# Altium schematic sheet Magnetic-Charger.SchDoc
size A; SheetNumber: 14; SheetTotal: 17
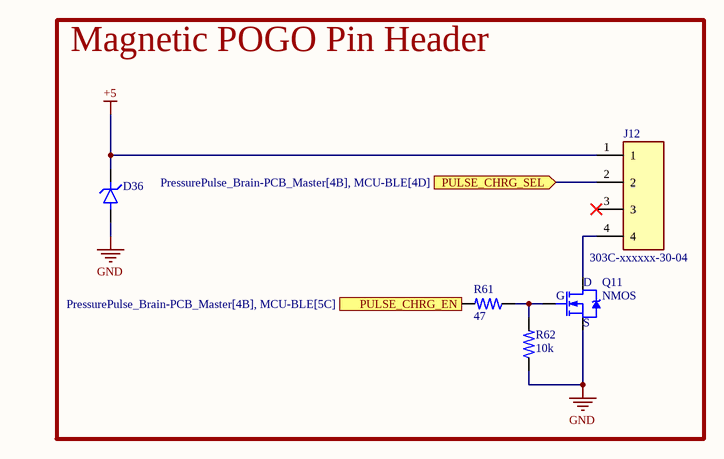
[diagram p0: Magnetic-Charger.SchDoc]

## Parts
D36  RCLAMP0521P.TCT  [BDFN2C051V40]  (value not drawn)
J12  303C-xxxxxx-30-04  [MAG POGO - 4 POS MALE]
Q11  NMOS  [SOT-23]
R61  value 47  [0402R]  (hidden comment: RES)
R62  value 10k  [0402R]  (hidden comment: RES)

## Blocks framed on the sheet
Magnetic POGO Pin Header: D36 J12 Q11 R61 R62

## Ports
PULSE_CHRG_EN (in, see PressurePulse_Brain-PCB_Master[4B], MCU-BLE[5C]), PULSE_CHRG_SEL (in, see PressurePulse_Brain-PCB_Master[4B], MCU-BLE[4D])

## Nets
+5: D36.K J12.1
GND: D36.A Q11.S R62.1
PULSE_CHRG_EN: R61.2 ; port PULSE_CHRG_EN
PULSE_CHRG_SEL: J12.2 ; port PULSE_CHRG_SEL
NetJ12_4: J12.4 Q11.D
NetQ11_G: Q11.G R61.1 R62.2

Not connected (* = marked no-connect by the designer): J12 3*

## Library data of the parts
D36 = TVS DIODE: 25V Clamp 4A (8/20µs) Ipp Tvs Diode Surface Mount SLP1006P2; MFR: BORN; Type: SMD; Value: BDFN2C051V40; MFR PN: BDFN2C051V40; JLCPCB PN: C152023
J12 = 303C-xxxxxx-30-04: MAGNETIC POGO 4POS; MFR: ATTEND Technology; MFR PN: 303C-321018-30-04; Value: DNS; JLCPCB PN: *
Q11 = NMOS: 100V 1.6A 1.3W 220mΩ@10V,1.6A N Channel SOT-23  MOSFETs ROHS; MFR: Infineon; Value: IRLML0100TRPBF; MFR PN: IRLML0100TRPBF; JLCPCB PN: C53658
R61 R62 = RES: Resistor; MFR PN: *; MFR: *
  R61: JLCPCB PN: *
  R62: JLCPCB PN: C843837